# EAGLE design NIRGM V8 (EAGLE 8.5.1)

## Sheet 1 of 7: Voltage Regulator
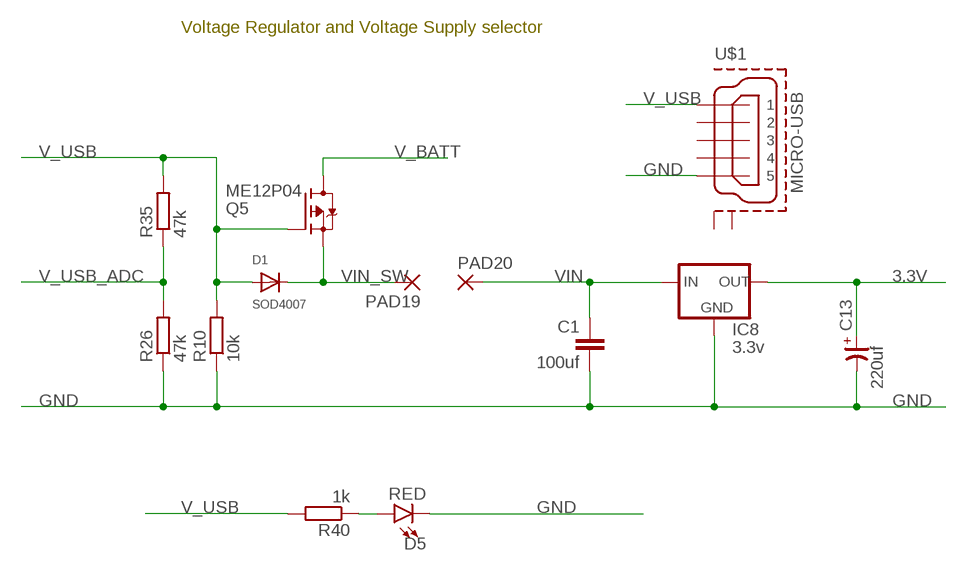
[diagram p0: schematic, sheet 1]

### Parts
C1  100uf  C-EUC1206K  [C1206K]
C13  220uf  CP-7343  [7343/T]
D1  SOD4007  DIODE_SOD-123FL  [SOD-123FL]
D5  RED  LED-GREEN1206  [LED-1206]
IC8  3.3v  LM1117TO252  [TO252]
PAD19  SMD2  [SMD1,27-2,54]
PAD20  SMD2  [SMD1,27-2,54]
Q5  ME12P04  FDD4141TO252  [TO252]
R10  10k  R-EU_R1206  [R1206]
R26  47k  R-EU_R1206  [R1206]
R35  47k  R-EU_R1206  [R1206]
R40  1k  R-EU_R1206  [R1206]
U$1  MICRO-USB  MICRO-USB-RECEPTACLE47589-0001  [47589-0001]

### Nets
3.3V: C13.+ IC8.3(OUT) ; also sheet 3,4,5,6,7
GND: C1.2 C13.- D5.C IC8.1(GND) R10.1 R26.1 U$1.5 ; also sheet 2,3,4,5,6,7
N$1: D5.A R40.1
V_BATT: Q5.3(D) ; also sheet 2,6
V_USB: D1.A Q5.1(G) R10.2 R35.2 R40.2 U$1.1 ; also sheet 2,6
V_USB_ADC: R26.2 R35.1 ; also sheet 4
VIN: C1.1 IC8.2(IN) PAD20.1(P)
VIN_SW: D1.C PAD19.1(P) Q5.2(S)
Unconnected: U$1.2 U$1.3 U$1.4 U$1.P$1(GND1) U$1.P$2(GND2)

### Notes on the sheet
- Voltage Regulator and Voltage Supply selector

## Sheet 2 of 7: Lithium-Polymer Battery Charger (1-cell)
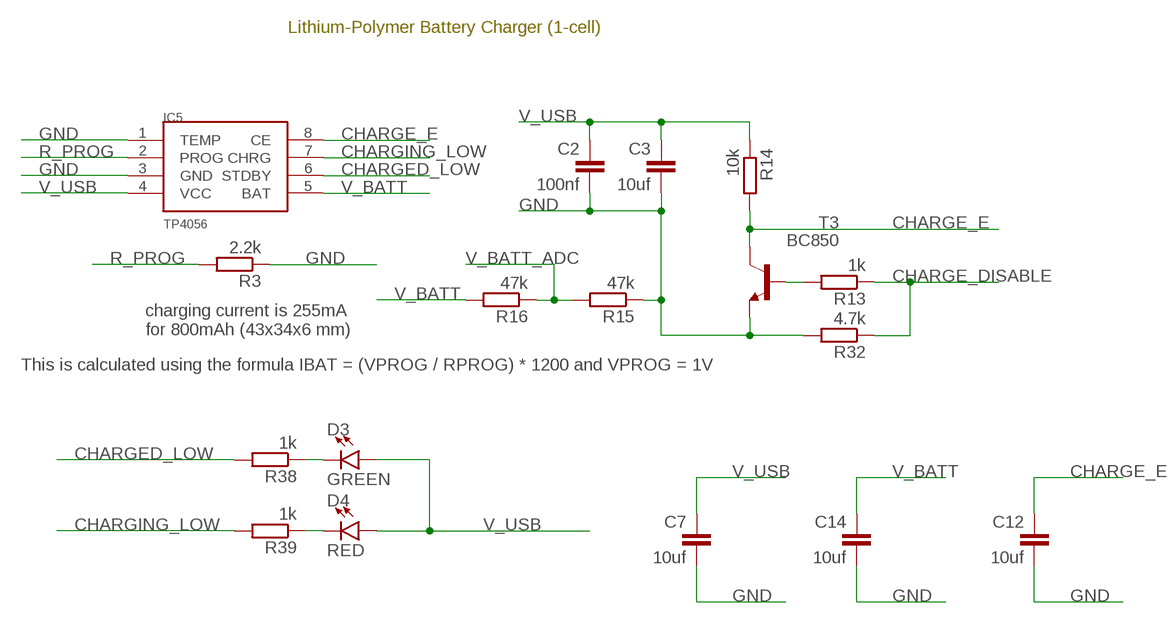
[diagram p1: schematic, sheet 2]

### Parts
C2  100nf  C-EUC1206K  [C1206K]
C3  10uf  C-EUC1206K  [C1206K]
C7  10uf  C-EUC1206K  [C1206K]
C12  10uf  C-EUC1206K  [C1206K]
C14  10uf  C-EUC1206K  [C1206K]
D3  GREEN  LED-GREEN1206  [LED-1206]
D4  RED  LED-GREEN1206  [LED-1206]
IC5  TP4056  [SOP-8]
R3  2.2k  R-EU_R1206  [R1206]
R13  1k  R-EU_R1206  [R1206]
R14  10k  R-EU_R1206  [R1206]
R15  47k  R-EU_R1206  [R1206]
R16  47k  R-EU_R1206  [R1206]
R32  4.7k  R-EU_R1206  [R1206]
R38  1k  R-EU_R1206  [R1206]
R39  1k  R-EU_R1206  [R1206]
T3  BC850  [SOT23]

### Nets
CHARGE_DISABLE: R13.1 R32.1 ; also sheet 4
CHARGE_E: C12.1 IC5.8(CE) R14.2 T3.3(C)
CHARGED_LOW: IC5.6(STDBY) R38.2 ; also sheet 4
CHARGING_LOW: IC5.7(CHRG) R39.2 ; also sheet 4
GND: C2.2 C3.2 C7.2 C12.2 C14.2 IC5.1(TEMP) IC5.3(GND) R3.1 R15.1 R32.2 T3.2(E) ; also sheet 1,3,4,5,6,7
N$2: D4.C R39.1
N$4: D3.C R38.1
N$13: R13.2 T3.1(B)
R_PROG: IC5.2(PROG) R3.2
V_BATT: C14.1 IC5.5(BAT) R16.2 ; also sheet 1,6
V_BATT_ADC: R15.2 R16.1 ; also sheet 4
V_USB: C2.1 C3.1 C7.1 D3.A D4.A IC5.4(VCC) R14.1 ; also sheet 1,6

### Notes on the sheet
- Lithium-Polymer Battery Charger (1-cell)
- charging current is 255mA
  for 800mAh (43x34x6 mm)
- This is calculated using the formula IBAT = (VPROG / RPROG) * 1200 and VPROG = 1V

## Sheet 3 of 7: LED Driver
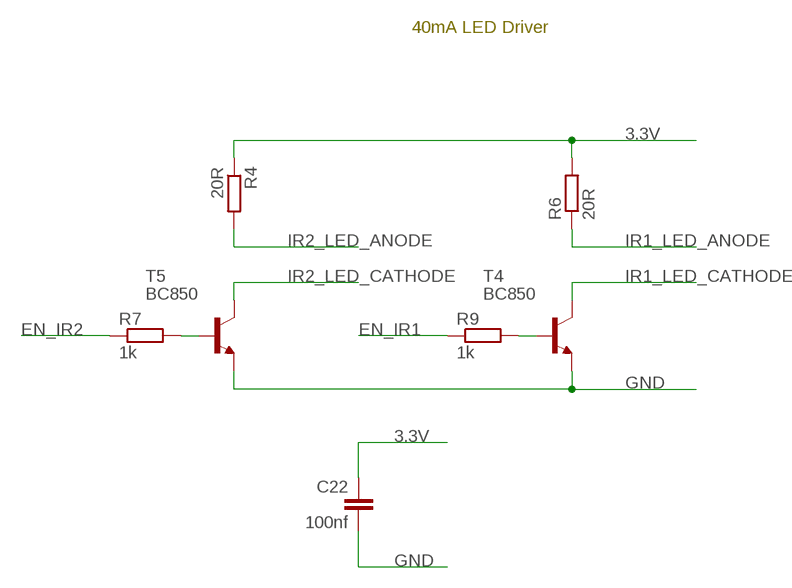
[diagram p2: schematic, sheet 3]

### Parts
C22  100nf  C-EUC1206K  [C1206K]
R4  20R  R-EU_R1206  [R1206]
R6  20R  R-EU_R1206  [R1206]
R7  1k  R-EU_R1206  [R1206]
R9  1k  R-EU_R1206  [R1206]
T4  BC850  [SOT23]
T5  BC850  [SOT23]

### Nets
3.3V: C22.1 R4.1 R6.2 ; also sheet 1,4,5,6,7
EN_IR1: R9.1 ; also sheet 4
EN_IR2: R7.1 ; also sheet 4
GND: C22.2 T4.2(E) T5.2(E) ; also sheet 1,2,4,5,6,7
IR1_LED_ANODE: R6.1 ; also sheet 6
IR1_LED_CATHODE: T4.3(C) ; also sheet 6
IR2_LED_ANODE: R4.2 ; also sheet 5
IR2_LED_CATHODE: T5.3(C) ; also sheet 5
N$3: R7.2 T5.1(B)
N$8: R9.2 T4.1(B)

### Notes on the sheet
- 40mA LED Driver

## Sheet 4 of 7: ESP32
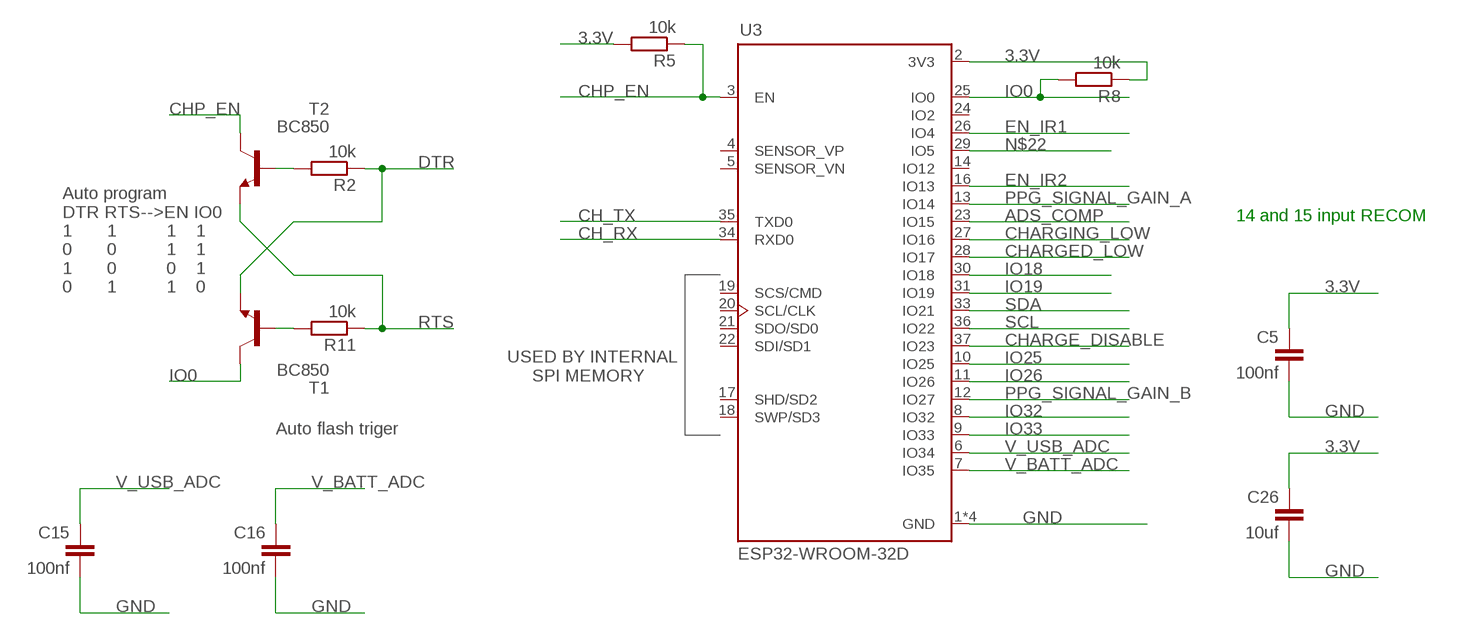
[diagram p3: schematic, sheet 4]

### Parts
C5  100nf  C-EUC1206K  [C1206K]
C15  100nf  C-EUC1206K  [C1206K]
C16  100nf  C-EUC1206K  [C1206K]
C26  10uf  C-EUC1206K  [C1206K]
R2  10k  R-EU_R1206  [R1206]
R5  10k  R-EU_R1206  [R1206]
R8  10k  R-EU_R1206  [R1206]
R11  10k  R-EU_R1206  [R1206]
T1  BC850  [SOT23]
T2  BC850  [SOT23]
U3  ESP32-WROOM-32D  [MODULE_ESP32-WROOM-32D]

### Nets
3.3V: C5.1 C26.1 R5.2 R8.1 U3.2(3V3) ; also sheet 1,3,5,6,7
ADS_COMP: U3.23(IO15) ; also sheet 7
CH_RX: U3.34(RXD0) ; also sheet 6
CH_TX: U3.35(TXD0) ; also sheet 6
CHARGE_DISABLE: U3.37(IO23) ; also sheet 2
CHARGED_LOW: U3.28(IO17) ; also sheet 2
CHARGING_LOW: U3.27(IO16) ; also sheet 2
CHP_EN: R5.1 T2.3(C) U3.3(EN) ; also sheet 6
DTR: R2.1 T1.2(E) ; also sheet 6
EN_IR1: U3.26(IO4) ; also sheet 3
EN_IR2: U3.16(IO13) ; also sheet 3
GND: C5.2 C15.2 C16.2 C26.2 U3.1(GND) U3.15(GND) U3.38(GND) U3.39(GND) ; also sheet 1,2,3,5,6,7
IO0: R8.2 T1.3(C) U3.25(IO0) ; also sheet 6
IO18: U3.30(IO18) ; also sheet 6
IO19: U3.31(IO19) ; also sheet 6
IO25: U3.10(IO25) ; also sheet 6
IO26: U3.11(IO26) ; also sheet 6
IO32: U3.8(IO32) ; also sheet 6
IO33: U3.9(IO33) ; also sheet 6
N$5: R11.2 T1.1(B)
N$18: R2.2 T2.1(B)
N$22: U3.29(IO5)
PPG_SIGNAL_GAIN_A: U3.13(IO14) ; also sheet 5
PPG_SIGNAL_GAIN_B: U3.12(IO27) ; also sheet 5
RTS: R11.1 T2.2(E) ; also sheet 6
SCL: U3.36(IO22) ; also sheet 6,7
SDA: U3.33(IO21) ; also sheet 6,7
V_BATT_ADC: C16.1 U3.7(IO35) ; also sheet 2
V_USB_ADC: C15.1 U3.6(IO34) ; also sheet 1
Unconnected: U3.4(SENSOR_VP) U3.5(SENSOR_VN) U3.14(IO12) U3.17(SHD/SD2) U3.18(SWP/SD3) U3.19(SCS/CMD) U3.20(SCL/CLK) U3.21(SDO/SD0) U3.22(SDI/SD1) U3.24(IO2)

### Notes on the sheet
- 14 and 15 input RECOM
- Auto program
  DTR RTS-->EN IO0 
  1       1          1    1
  0       0          1    1
  1       0          0    1
  0       1          1    0
- USED BY INTERNAL
       SPI MEMORY
- Auto flash triger

## Sheet 5 of 7: Programable gain amplifier
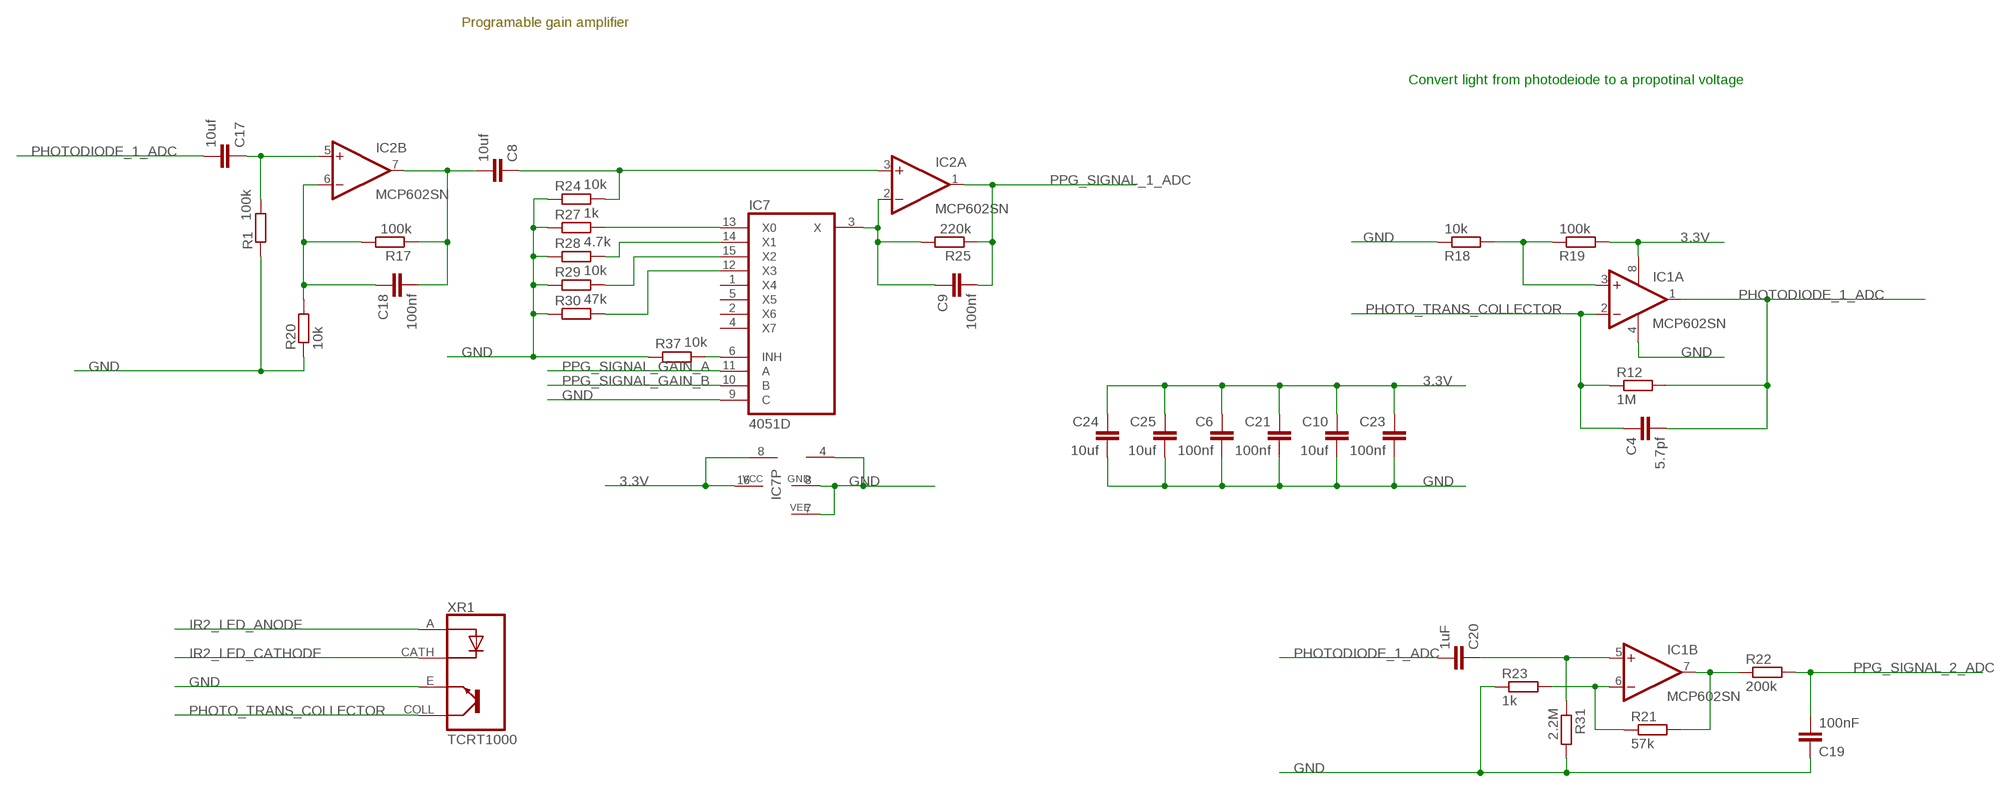
[diagram p4: schematic, sheet 5]

### Parts
C4  5.7pf  C-EUC1206K  [C1206K]
C6  100nf  C-EUC1206K  [C1206K]
C8  10uf  C-EUC1206K  [C1206K]
C9  100nf  C-EUC1206K  [C1206K]
C10  10uf  C-EUC1206K  [C1206K]
C17  10uf  C-EUC1206K  [C1206K]
C18  100nf  C-EUC1206K  [C1206K]
C19  100nF  C-EUC1206K  [C1206K]
C20  1uF  C-EUC1206K  [C1206K]
C21  100nf  C-EUC1206K  [C1206K]
C23  100nf  C-EUC1206K  [C1206K]
C24  10uf  C-EUC1206K  [C1206K]
C25  10uf  C-EUC1206K  [C1206K]
IC1  MCP602SN  [SO08]
IC2  MCP602SN  [SO08]
IC7  4051D  [SO16]
R1  100k  R-EU_R1206  [R1206]
R12  1M  R-EU_R1206  [R1206]
R17  100k  R-EU_R1206  [R1206]
R18  10k  R-EU_R1206  [R1206]
R19  100k  R-EU_R1206  [R1206]
R20  10k  R-EU_R1206  [R1206]
R21  57k  R-EU_R1206  [R1206]
R22  200k  R-EU_R1206  [R1206]
R23  1k  R-EU_R1206  [R1206]
R24  10k  R-EU_R1206  [R1206]
R25  220k  R-EU_R1206  [R1206]
R27  1k  R-EU_R1206  [R1206]
R28  4.7k  R-EU_R1206  [R1206]
R29  10k  R-EU_R1206  [R1206]
R30  47k  R-EU_R1206  [R1206]
R31  2.2M  R-EU_R1206  [R1206]
R37  10k  R-EU_R1206  [R1206]
XR1  TCRT1000  [XDCR_TCRT1000]

### Nets
3.3V: C6.1 C10.1 C21.1 C23.1 C24.1 C25.1 IC1.8(P:V+) IC2.8(P:V+) IC7.16(VCC) R19.2 ; also sheet 1,3,4,6,7
GND: C6.2 C10.2 C19.1 C21.2 C23.2 C24.2 C25.2 IC1.4(P:V-) IC2.4(P:V-) IC7.7(VEE) IC7.8(GND) IC7.9(C) R1.1 R18.1 R20.1 R23.1 R24.1 R27.1 R28.1 R29.1 R30.1 R31.2 R37.1 XR1.E ; also sheet 1,2,3,4,6,7
IR2_LED_ANODE: XR1.A ; also sheet 3
IR2_LED_CATHODE: XR1.CATH(C) ; also sheet 3
N$6: C17.1 IC2.5(B:+IN) R1.2
N$10: IC1.3(A:+IN) R18.2 R19.1
N$11: IC7.6(INH) R37.2
N$12: C8.2 C18.2 IC2.7(B:OUT) R17.1
N$14: C18.1 IC2.6(B:-IN) R17.2 R20.2
N$15: IC1.6(B:-IN) R21.1 R23.2
N$16: C20.1 IC1.5(B:+IN) R31.1
N$17: IC1.7(B:OUT) R21.2 R22.1
N$29: C8.1 IC2.3(A:+IN) R24.2
N$39: C9.1 IC2.2(A:-IN) IC7.3(X) R25.2
N$40: IC7.13(X0) R27.2
N$41: IC7.14(X1) R28.2
N$42: IC7.15(X2) R29.2
N$43: IC7.12(X3) R30.2
PHOTO_TRANS_COLLECTOR: C4.1 IC1.2(A:-IN) R12.1 XR1.COLL(CO)
PHOTODIODE_1_ADC: C4.2 C17.2 C20.2 IC1.1(A:OUT) R12.2 ; also sheet 7
PPG_SIGNAL_1_ADC: C9.2 IC2.1(A:OUT) R25.1 ; also sheet 7
PPG_SIGNAL_2_ADC: C19.2 R22.2 ; also sheet 7
PPG_SIGNAL_GAIN_A: IC7.11(A) ; also sheet 4
PPG_SIGNAL_GAIN_B: IC7.10(B) ; also sheet 4
Unconnected: IC7.1(X4) IC7.2(X6) IC7.4(X7) IC7.5(X5)

### Notes on the sheet
- Programable gain amplifier
- Convert light from photodeiode to a propotinal voltage

## Sheet 6 of 7: OLED LCD and Connectors
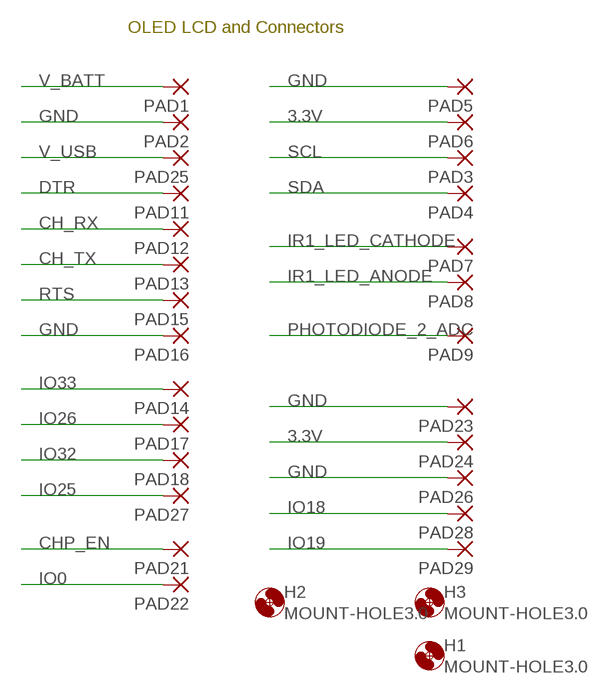
[diagram p5: schematic, sheet 6]

### Parts
H1  MOUNT-HOLE3.0  [3,0]
H2  MOUNT-HOLE3.0  [3,0]
H3  MOUNT-HOLE3.0  [3,0]
PAD1  WIREPADSMD5-2,5  [5-2,5]
PAD2  WIREPADSMD5-2,5  [5-2,5]
PAD3  SMD2  [SMD1,27-2,54]
PAD4  SMD2  [SMD1,27-2,54]
PAD5  SMD2  [SMD1,27-2,54]
PAD6  SMD2  [SMD1,27-2,54]
PAD7  SMD2  [SMD1,27-2,54]
PAD8  SMD2  [SMD1,27-2,54]
PAD9  SMD2  [SMD1,27-2,54]
PAD11  SMD2  [SMD1,27-2,54]
PAD12  SMD2  [SMD1,27-2,54]
PAD13  SMD2  [SMD1,27-2,54]
PAD14  SMD2  [SMD1,27-2,54]
PAD15  SMD2  [SMD1,27-2,54]
PAD16  SMD2  [SMD1,27-2,54]
PAD17  SMD2  [SMD1,27-2,54]
PAD18  SMD2  [SMD1,27-2,54]
PAD21  SMD2  [SMD1,27-2,54]
PAD22  SMD2  [SMD1,27-2,54]
PAD23  SMD2  [SMD1,27-2,54]
PAD24  SMD2  [SMD1,27-2,54]
PAD25  SMD2  [SMD1,27-2,54]
PAD26  SMD2  [SMD1,27-2,54]
PAD27  SMD2  [SMD1,27-2,54]
PAD28  SMD2  [SMD1,27-2,54]
PAD29  SMD2  [SMD1,27-2,54]

### Nets
3.3V: PAD6.1(P) PAD24.1(P) ; also sheet 1,3,4,5,7
CH_RX: PAD12.1(P) ; also sheet 4
CH_TX: PAD13.1(P) ; also sheet 4
CHP_EN: PAD21.1(P) ; also sheet 4
DTR: PAD11.1(P) ; also sheet 4
GND: PAD2.1(P) PAD5.1(P) PAD16.1(P) PAD23.1(P) PAD26.1(P) ; also sheet 1,2,3,4,5,7
IO0: PAD22.1(P) ; also sheet 4
IO18: PAD28.1(P) ; also sheet 4
IO19: PAD29.1(P) ; also sheet 4
IO25: PAD27.1(P) ; also sheet 4
IO26: PAD17.1(P) ; also sheet 4
IO32: PAD18.1(P) ; also sheet 4
IO33: PAD14.1(P) ; also sheet 4
IR1_LED_ANODE: PAD8.1(P) ; also sheet 3
IR1_LED_CATHODE: PAD7.1(P) ; also sheet 3
PHOTODIODE_2_ADC: PAD9.1(P) ; also sheet 7
RTS: PAD15.1(P) ; also sheet 4
SCL: PAD3.1(P) ; also sheet 4,7
SDA: PAD4.1(P) ; also sheet 4,7
V_BATT: PAD1.1(P) ; also sheet 1,2
V_USB: PAD25.1(P) ; also sheet 1,2

### Notes on the sheet
- OLED LCD and Connectors

## Sheet 7 of 7: ADS1115
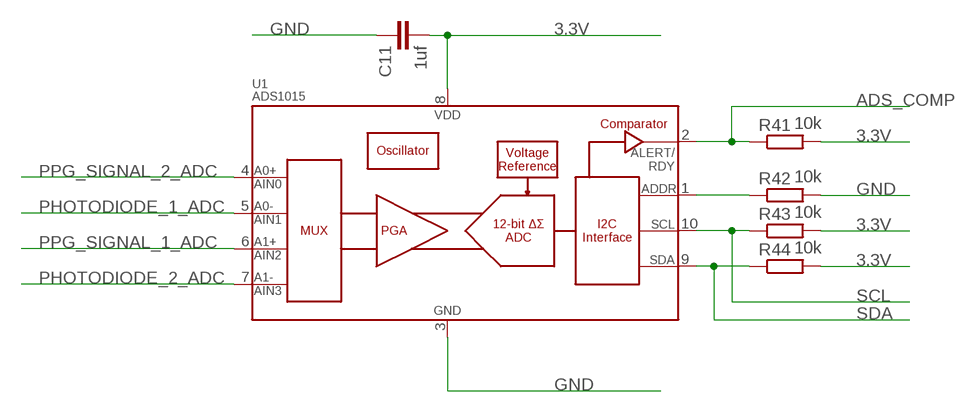
[diagram p6: schematic, sheet 7]

### Parts
C11  1uf  C-EUC1206K  [C1206K]
R41  10k  R-EU_R1206  [R1206]
R42  10k  R-EU_R1206  [R1206]
R43  10k  R-EU_R1206  [R1206]
R44  10k  R-EU_R1206  [R1206]
U1  ADS1015  [MSOP10]

### Nets
3.3V: C11.2 R41.2 R43.2 R44.2 U1.8(VDD) ; also sheet 1,3,4,5,6
ADS_COMP: R41.1 U1.2(ALERT/RDY) ; also sheet 4
GND: C11.1 R42.2 U1.3(VSS) ; also sheet 1,2,3,4,5,6
N$9: R42.1 U1.1(ADDR)
PHOTODIODE_1_ADC: U1.5(AIN1) ; also sheet 5
PHOTODIODE_2_ADC: U1.7(AIN3) ; also sheet 6
PPG_SIGNAL_1_ADC: U1.6(AIN2) ; also sheet 5
PPG_SIGNAL_2_ADC: U1.4(AIN0) ; also sheet 5
SCL: R43.1 U1.10(SCL) ; also sheet 4,6
SDA: R44.1 U1.9(SDA) ; also sheet 4,6

## Library data of the parts
C1-C12 C14-C26 = rcl:C-EU: CAPACITOR, European symbol; SPICEPREFIX: C
C13 = cap-master:CP-: POLARIZED CAP
D1 = adafruit:DIODE: Diode SMADIODE - SMA Surface Mount Package 20V 1A Schottky Diode Digikey: 641-1014-6-ND DO-1N4148 - Through Hole Small Current Diode SOD-123 20V 1 A (.5mV Vf) Schottky Diode - Digikey: MBRX120TPMSCT-ND SOD-323 10V 570mA (.38mV Vf, 3ns) Schottky Diode - Digikey: ZLLS410CT-ND SOD-523 30V 30mA Schottky Diode (RB751S-40TE61) - Digikey: RB751S-40TE61CT-ND SOT23-R/W - SOT23 Package (R = Solder Paste/Reflow Ovens, W = Hand-Soldering) BAT54Film 40V 300mA - Digikey: 497-7162-1-ND
D3 = SparkFun-LED:LED-GREEN: Green SMD LED Used in manufacturing of various products at SparkFun Packages: 0603 - SMD 0603 package [Product Link] <http://www.futureelectronics.com/en/technologies/semiconductors/optoelectronics/leds/Pages/9894312-LTST-C190GKT.aspx?CrossPart=HSMG-C190&IM=0> LilyPad 1206 - SMD1206 LilyPad package [Product Link] <http://www.futureelectronics.com/en/Technologies/Product.aspx?ProductID=IN150NGHARVATEKCORPORATION2049943&IM=0> 1206 - SMD1206 package [Product Link] <http://www.futureelectronics.com/en/technologies/semiconductors/optoelectronics/leds/Pages/8315665-LTST-C150KGKT.aspx?IM=0> 1206 Bottom Mount -SMD 1206 Bottom Mount [Product Link] <http://www.digikey.com/product-detail/en/lite-on-inc/LTST-C230KGKT/160-1456-1-ND/386854> SparkFun Products: Pro Mini 328 -5V <https://www.sparkfun.com/products/821> RedBoard <https://www.sparkfun.com/products/12757> MP3 Trigger <https://www.sparkfun.com/products/13720> Makey Makey <https://www.sparkfun.com/products/11076>; PROD_ID: DIO-00862
D4 D5 = SparkFun-LED:LED-GREEN: Green SMD LED Used in manufacturing of various products at SparkFun Packages: 0603 - SMD 0603 package [Product Link] <http://www.futureelectronics.com/en/technologies/semiconductors/optoelectronics/leds/Pages/9894312-LTST-C190GKT.aspx?CrossPart=HSMG-C190&IM=0> LilyPad 1206 - SMD1206 LilyPad package [Product Link] <http://www.futureelectronics.com/en/Technologies/Product.aspx?ProductID=IN150NGHARVATEKCORPORATION2049943&IM=0> 1206 - SMD1206 package [Product Link] <http://www.futureelectronics.com/en/technologies/semiconductors/optoelectronics/leds/Pages/8315665-LTST-C150KGKT.aspx?IM=0> 1206 Bottom Mount -SMD 1206 Bottom Mount [Product Link] <http://www.digikey.com/product-detail/en/lite-on-inc/LTST-C230KGKT/160-1456-1-ND/386854> SparkFun Products: Pro Mini 328 -5V <https://www.sparkfun.com/products/821> RedBoard <https://www.sparkfun.com/products/12757> MP3 Trigger <https://www.sparkfun.com/products/13720> Makey Makey <https://www.sparkfun.com/products/11076>; PROD_ID: DIO-00862; VALUE: GREEN
H1-H3 = holes:MOUNT-HOLE: MOUNTING HOLE with drill center marker
IC1 IC2 = linear:MCP602: Single Op Amp 2.7V to 6.0V Single Supply CMOS Source: http://ww1.microchip.com/downloads/en/DeviceDoc/21314g.pdf
IC5 = TP4056:TP4056
IC7 = 40xx:4051: 8-channel ANALOG MULTIPLEXER
IC8 = v-reg-2:LM1117
PAD1 PAD2 = wirepad:WIREPAD: Wire PAD connect wire on PCB
PAD3-PAD9 PAD11-PAD29 = wirepad:SMD2: SMD PAD
Q5 = transistor-fet:FDD4141: P-Channel PowerTrench® MOSFET Source: FDD4141.pdf
R1-R32 R35 R37-R44 = rcl:R-EU_: RESISTOR, European symbol; SPICEPREFIX: R
T1-T5 = transistor:BC850: NPN TRANSISTOR
U1 = SparkFun-IC-Conversion:ADS1015: ADS1015 12-BIT ADC 12-Bit Del-Sig ADC Four single-ended inputs or two differential inputs Internal PGA I2C interface 2.0-5.5V SparkFun Products SparkFun Block for Intel Edison - ADC <https://www.sparkfun.com/products/13770> (DEV-13770); PROD_ID: IC-12270
U3 = ESP32-WROOM-32DMODED:ESP32-WROOM-32D: IC: SoC; GPIO, I2C, I2S, IR, SD, SDIO, SPI, UART; 2.7÷3.6VDC; 20dBm; AVAILABILITY: Unavailable; DESCRIPTION: IC: SoC; GPIO, I2C, I2S, IR, SD, SDIO, SPI, UART; 2.7÷3.6VDC; 20dBm; MF: Espressif Systems; MP: ESP32-WROOM-32D; PACKAGE: Module Espressif Systems; PRICE: None
U$1 = con-molex-usb:MICRO-USB-RECEPTACLE: MICRO USB RECEPTACLES Micro-USB Receptacles, SMT, Lead-Free from MOLEX <http://www.molex.com/>. (C) 2014 Tomasz Boleslaw CEDRO, cederom@tlen.pl, http://www.tomek.cedro.info. Version 0.1 (2014-01-17): Initial release. Version 0.2 (2014-02-06): Updated 47589-0001 footprint pins/pads/milling. Following devices are included: 1. 47589-0001 Micro-USB AB Receptacle, Bottom Mount, SMT, Lead-Free <http://www.molex.com/molex/products/datasheet.jsp?part=active/0475890001_IO_CONNECTORS.xml> (Technical Drawing <http://www.molex.com/pdm_docs/sd/475890001_sd.pdf>).
XR1 = TCRT1000:TCRT1000: Optical Sensor The TCRT1000 and TCRT1010 are reflective sensors which include an infrared emitter and phototransistor in a leaded package which blocks visible light; AVAILABILITY: Unavailable; DESCRIPTION: 950 nm 50 mA Through Hole Reflective Optical Sensor with Transistor Output; MF: Vishay; MP: TCRT1000; PACKAGE: PCB Mount Vishay; PRICE: None

## Board
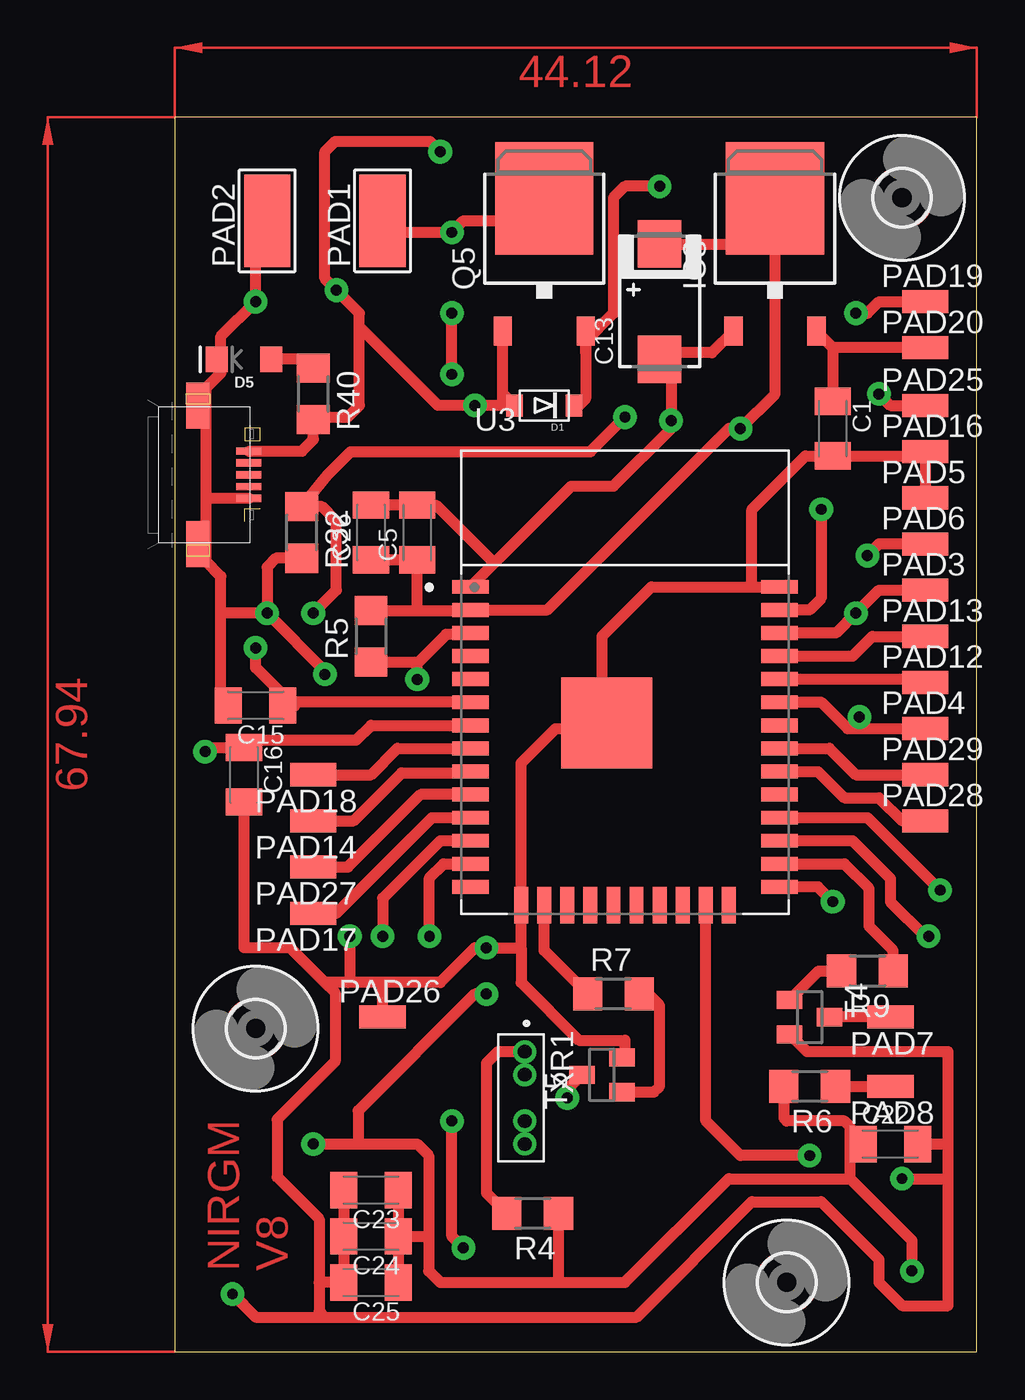
[diagram p7: board, top side]
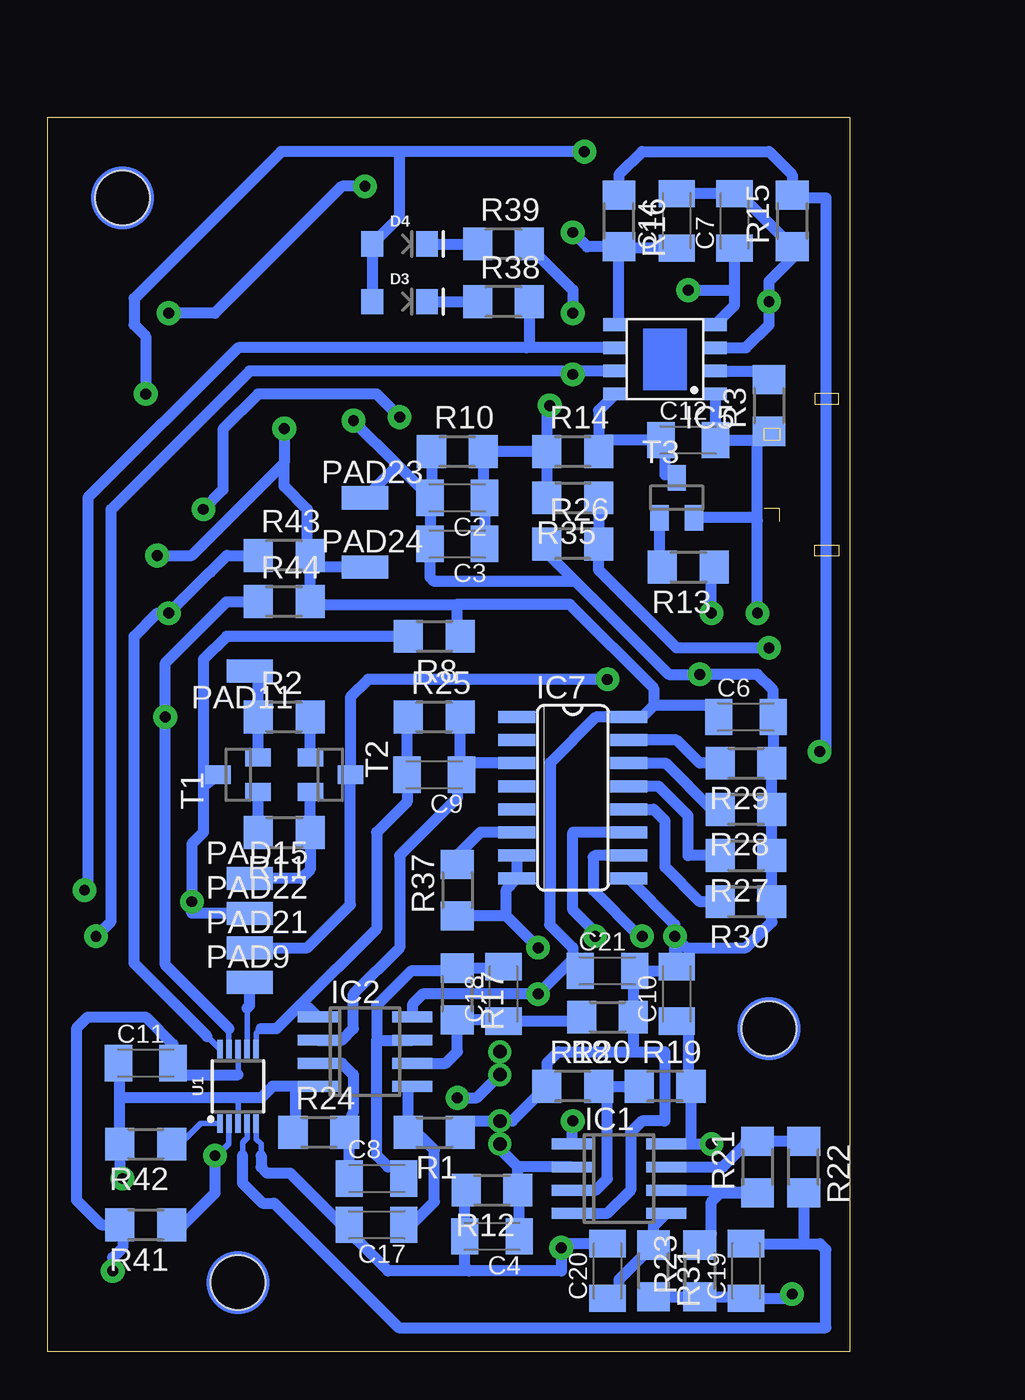
[diagram p8: board, bottom side, seen from below]

Size 44.12 x 67.94 mm. Coordinates in mm from the lower left corner, seen from the top.
Outline: 0,0 44.12,0 44.12,67.94 0,67.94 0,0
Copper layers (1*16): Top 0.035mm / dielectric 1.5mm / Bottom 0.035mm
Design rules "default *": minimum track width 6mil, minimum drill 0.35mm, track to track 12mil, track to pad 12mil, pad to pad 6mil, via to via 6mil, smd to smd 6mil, copper to edge 40mil, drill to drill 6mil, minimum pad ring 10mil, minimum via ring 8mil, stop-mask expansion 4mil, vias tented up to drill 0mil, thermal gap 10mil

### Footprints (pad centres in the part's own frame; a part is rotated, then mirrored left to right if it is on the bottom)
C1206K = smd 1.5 x 2: 1 -1.5,0; 2 1.5,0
7343/T = smd 2.6 x 2.4: + 3.175,0; - -3.175,0
SOD-123FL = smd 0.91 x 1.22: A 1.637,0; C -1.637,0
LED-1206 = smd 1.2 x 1.4: A -1.5,0; C 1.5,0
3,0 = hole 3: 0,0
SO08 = smd 0.6 x 2.2: 1 -1.905,-2.6; 2 -0.635,-2.6; 3 0.635,-2.6; 4 1.905,-2.6; 5 1.905,2.6; 6 0.635,2.6; 7 -0.635,2.6; 8 -1.905,2.6
SOP-8 = smd 1.3 x 0.7: 1 -2.75,1.905; 2 -2.75,0.635; 3 -2.75,-0.635; 4 -2.75,-1.905; 5 2.75,-1.905; 6 2.75,-0.635; 7 2.75,0.635; 8 2.75,1.905
SO16 = smd 0.66 x 2.032: 1 -4.445,-3.073; 2 -3.175,-3.073; 3 -1.905,-3.073; 4 -0.635,-3.073; 5 0.635,-3.073; 6 1.905,-3.073; 7 3.175,-3.073; 8 4.445,-3.073; 9 4.445,3.073; 10 3.175,3.073; 11 1.905,3.073; 12 0.635,3.073; 13 -0.635,3.073; 14 -1.905,3.073; 15 -3.175,3.073; 16 -4.445,3.073
TO252 = smd 1 x 1.6: 1 -2.28,-6.07; 2 2.28,-6.07 | smd 5.4 x 6.2: 3 0,1.23
5-2,5 = smd 2.54 x 5.08: 1 0,0
SMD1,27-2,54 = smd 1.27 x 2.54: 1 0,0
TO252' = smd 1 x 1.6: 1 -2.28,-4.8; 2 2.28,-4.8 | smd 5.4 x 6.2: 3 0,2.5
R1206 = smd 1.6 x 1.803: 1 -1.422,0; 2 1.422,0
SOT23 = smd 1 x 1.4: 1 -0.95,-1.1; 2 0.95,-1.1; 3 0,1.1
MSOP10 = smd 0.3 x 1: 1 -1,-2.05; 2 -0.5,-2.05; 3 0,-2.05; 4 0.5,-2.05; 5 1,-2.05; 6 1,2.05; 7 0.5,2.05; 8 0,2.05; 9 -0.5,2.05; 10 -1,2.05
MODULE_ESP32-WROOM-32D = smd 2 x 0.762: 1 -8.5,5.26; 2 -8.5,3.99; 3 -8.5,2.72; 4 -8.5,1.45; 5 -8.5,0.18; 6 -8.5,-1.09; 7 -8.5,-2.36; 8 -8.5,-3.63; 9 -8.5,-4.9; 10 -8.5,-6.17; 11 -8.5,-7.44; 12 -8.5,-8.71; 13 -8.5,-9.98; 14 -8.5,-11.25; 25 8.5,-11.25; 26 8.5,-9.98; 27 8.5,-8.71; 28 8.5,-7.44; 29 8.5,-6.17; 30 8.5,-4.9; 31 8.5,-3.63; 32 8.5,-2.36; 33 8.5,-1.09; 34 8.5,0.18; 35 8.5,1.45; 36 8.5,2.72; 37 8.5,3.99; 38 8.5,5.26 | smd 0.762 x 2: 15 -5.715,-12.25; 16 -4.445,-12.25; 17 -3.175,-12.25; 18 -1.905,-12.25; 19 -0.635,-12.25; 20 0.635,-12.25; 21 1.905,-12.25; 22 3.175,-12.25; 23 4.445,-12.25; 24 5.715,-12.25 | smd 5 x 5: 39 -1,-2.24
47589-0001 = smd 1.35 x 0.4: 1 2.8,1.3; 2 2.8,0.65; 3 2.8,0; 4 2.8,-0.65; 5 2.8,-1.3 | smd 1.27 x 2.54: P$1 0,3.81; P$2 0,-3.81
XDCR_TCRT1000 = drill 0.75 pad 1.1: A -2.54,0.2; CATH -1.27,0.2; COLL 2.54,0.2; E 1.27,0.2

### Placement (x,y rotation side)
C1  36.2,50.8 270 top
C2  21.59,46.99 180 bottom
C3  21.59,44.45 180 bottom
C4  19.68,6.35 180 bottom
C5  13.34,45.09 90 top
C6  5.71,34.92 0 bottom
C7  6.35,62.23 90 bottom
C8  26.04,9.53 0 bottom
C9  22.86,31.75 180 bottom
C10  9.53,19.68 90 bottom
C11  38.73,15.88 0 bottom
C12  8.89,50.16 0 bottom
C13  26.67,57.78 90 top
C14  9.53,62.23 90 bottom
C15  4.45,35.56 180 top
C16  3.81,31.75 270 top
C17  26.04,6.99 180 bottom
C18  19.05,19.68 90 bottom
C19  5.71,4.45 90 bottom
C20  13.34,4.45 90 bottom
C21  13.34,20.95 0 bottom
C22  39.37,11.43 0 top
C23  10.79,8.89 180 top
C24  10.79,6.35 180 top
C25  10.79,3.81 180 top
C26  10.79,45.09 90 top
D1  20.32,52.07 180 top
D3  24.77,57.78 0 bottom
D4  24.77,60.96 0 bottom
D5  3.81,54.61 180 top
H1  40.01,63.5 0 top
H2  4.45,17.78 0 top
H3  33.66,3.81 0 top
IC1  12.7,9.53 270 bottom
IC2  26.67,16.51 270 bottom
IC5  10.16,54.61 180 bottom
IC7  15.24,30.48 270 bottom
IC8  33.02,62.23 0 top
PAD1  11.43,62.23 0 top
PAD2  5.08,62.23 0 top
PAD3  41.27,41.91 270 top
PAD4  41.27,34.29 270 top
PAD5  41.27,46.99 270 top
PAD6  41.27,44.45 270 top
PAD7  39.37,18.41 90 top
PAD8  39.37,14.61 90 top
PAD9  33.02,20.32 270 bottom
PAD11  33.02,37.47 90 bottom
PAD12  41.27,36.83 270 top
PAD13  41.27,39.37 270 top
PAD14  7.62,29.21 90 top
PAD15  33.02,26.04 270 bottom
PAD16  41.27,49.53 270 top
PAD17  7.62,24.13 90 top
PAD18  7.62,31.75 90 top
PAD19  41.27,57.78 270 top
PAD20  41.27,55.24 270 top
PAD21  33.02,22.23 270 bottom
PAD22  33.02,24.13 270 bottom
PAD23  26.67,46.99 270 bottom
PAD24  26.67,43.18 270 bottom
PAD25  41.27,52.07 270 top
PAD26  11.43,18.41 270 top
PAD27  7.62,26.67 90 top
PAD28  41.27,29.21 270 top
PAD29  41.27,31.75 270 top
Q5  ME12P04  [TO252']  20.32,60.96 0 top
R1  22.86,12.06 180 bottom
R2  31.11,34.92 0 bottom
R3  4.45,52.07 90 bottom
R4  19.68,7.62 180 top
R5  10.79,39.37 90 top
R6  34.92,14.61 180 top
R7  24.13,19.68 0 top
R8  22.86,39.37 180 bottom
R9  38.1,20.95 180 top
R10  21.59,49.53 0 bottom
R11  31.11,28.57 180 bottom
R12  19.68,8.89 180 bottom
R13  8.89,43.18 180 bottom
R14  15.24,49.53 0 bottom
R15  3.17,62.23 90 bottom
R16  12.7,62.23 270 bottom
R17  21.59,19.68 270 bottom
R18  15.24,14.61 0 bottom
R19  10.16,14.61 0 bottom
R20  13.34,18.41 180 bottom
R21  5.08,10.16 90 bottom
R22  2.54,10.16 270 bottom
R23  8.26,4.45 90 bottom
R24  29.21,12.06 0 bottom
R25  22.86,34.92 0 bottom
R26  15.24,44.45 0 bottom
R27  5.71,27.3 180 bottom
R28  5.71,29.84 180 bottom
R29  5.71,32.38 180 bottom
R30  5.71,24.77 180 bottom
R31  10.79,4.45 270 bottom
R32  6.99,45.09 270 top
R35  15.24,46.99 180 bottom
R37  21.59,25.4 90 bottom
R38  19.05,57.78 0 bottom
R39  19.05,60.96 0 bottom
R40  7.62,52.7 270 top
R41  38.73,6.99 180 bottom
R42  38.73,11.43 180 bottom
R43  31.11,43.81 0 bottom
R44  31.11,41.27 0 bottom
T1  33.66,31.75 90 bottom
T2  28.57,31.75 270 bottom
T3  9.53,46.99 0 bottom
T4  34.92,18.41 270 top
T5  23.5,15.24 90 top
U1  33.66,14.61 0 bottom
U3  24.77,36.83 0 top
U$1  1.27,48.26 0 top
XR1  19.05,13.97 270 top

### Tracks (layer width: path | path; a pad name or v marks a point on that pad's centre or on a via)
3.3V  (via drill 0.6 pad 1.3)
  Top 0.61: IC8.3 33.02,52.7 v31.11,50.8 30.48,50.8 20.5,40.82 U3.2 16.24,40.79 13.34,40.79 | IC8.3 32.12,63.09 | R5.2 13.34,40.79 | 13.34,40.79 C5.1 C26.1 | C13.+ 31.75,60.96 32.98,62.19 IC8.3 | 33.5,13.82 R6.2 33.5,12.85 33.66,12.7 36.83,12.7 37.15,12.38 37.15,11.43 | v17.14,19.68 16.51,19.68 10.09,13.27 IC1.8 | 20.95,3.81 14.61,3.81 13.97,4.45 13.97,6.35 | 20.95,3.81 24.77,3.81 30.48,9.53 37.15,9.53 | 37.15,9.53 37.15,11.43 | 37.15,9.53 40.55,6.12 v40.55,4.45 | C22.1 37.15,11.43 | v7.62,11.43 IC1.8 | IC1.8 13.34,11.43 13.97,10.79 13.97,6.35 | C23.1 C24.1 | C24.1 C25.1 | C24.1 13.97,6.35 | PAD6.1 38.73,44.45 v38.1,43.81 | R4.1 21.11,3.96 20.95,3.81
  Bottom 0.305: 33.66,15.24 U1.8
  Bottom 0.61: v31.11,50.8 31.11,48.9 | v38.1,43.81 36.2,43.81 31.11,48.9 | 29.69,43.18 R44.2 29.54,41.12 21.59,41.12 | 29.69,43.18 R43.2 29.84,43.97 29.84,46.35 31.11,47.62 31.11,48.9 | 33.66,15.24 36.6,15.24 C11.2 37.23,16.91 38.73,18.41 41.91,18.41 42.55,17.78 42.55,8.35 41.18,6.99 R41.2 40.01,6.83 40.01,5.71 40.55,5.17 v40.55,4.45 | 10.79,35.56 10.79,36.52 15.39,41.12 21.59,41.12 | C6.1 7.85,35.56 10.79,35.56 | R8.1 21.59,39.52 21.59,41.12 | PAD24.1 29.69,43.18 | 10.79,35.56 11.43,34.92 IC7.16 13.97,34.92 16.48,32.41 16.48,25.37 16.51,25.34 16.51,23.5 15.24,22.23 15.24,21.59 | IC2.8 24.07,19.11 23.5,19.68 v17.14,19.68 15.24,21.59 | IC1.8 8.89,11.43 | 8.89,11.43 v7.62,11.43 | C21.1 14.84,21.18 15.24,21.59 | C10.1 8.89,17.55 8.89,14.76 R19.2 8.74,11.58 8.89,11.43
ADS_COMP  (via drill 0.6 pad 1.3)
  Top 0.61: v34.92,10.79 31.11,10.79 29.21,12.7 U3.23
  Bottom 0.305: U1.2 34.16,11.43 34.79,10.79 v34.92,10.79
  Bottom 0.61: v34.92,10.79 34.92,8.72 36.66,6.99 R41.1
CH_RX
  Top 0.61: PAD12.1 41.09,37.01 U3.34
CH_TX
  Top 0.61: U3.35 37.28,38.28 38.38,39.37 PAD13.1
CHARGE_DISABLE  (via drill 0.6 pad 1.3)
  Top 0.61: v24.77,51.44 22.86,49.53 9.68,49.53 8.41,48.26 R32.1 8.1,46.51 8.89,45.72 8.89,41.91 v7.62,40.64 | U3.37 34.92,40.82 35.56,41.45 v35.56,46.35
  Bottom 0.61: v7.62,40.64 7.62,43.18 R13.1 | v35.56,46.35 34.48,47.43 34.48,50.77 32.55,52.7 26.04,52.7 v24.77,51.44
CHARGE_E
  Bottom 0.61: IC5.8 13.82,51.8 13.82,50.16 | 13.82,50.16 R14.2 | 13.82,50.16 C12.1 10.16,49.94 10.16,48.26 9.7,48.26 T3.3
CHARGED_LOW  (via drill 0.6 pad 1.3)
  Top 0.61: U3.28 38.1,29.39 v42.09,25.4 v42.1,25.4
  Bottom 0.61: IC5.6 17.78,55.24 | 17.78,55.24 33.66,55.24 41.91,46.99 41.91,25.59 v42.1,25.4 | R38.2 17.63,55.4 17.78,55.24
CHARGING_LOW  (via drill 0.6 pad 1.3)
  Top 0.61: v15.24,53.78 v15.24,57.15 | U3.27 37.28,28.12 39.37,26.04 39.37,24.77 41.27,22.86 v41.47,22.86
  Bottom 0.61: IC5.7 15.24,53.98 | 15.24,53.98 v15.24,53.78 | v15.24,57.15 15.24,58.42 17.63,60.81 R39.2 | 15.24,53.98 33.02,53.98 40.64,46.35 40.64,23.69 v41.47,22.86
CHP_EN  (via drill 0.6 pad 1.3)
  Top 0.61: U3.3 16.19,39.47 14.93,39.47 13.34,37.88 | v13.34,37 13.34,37.88 | R5.1 13.27,37.95 13.34,37.88
  Bottom 0.61: v13.34,37 26.5,37 27.48,36.02 T2.3 27.48,24.59 29.84,22.23 PAD21.1
DTR
  Bottom 0.61: T1.2 32.55,34.91 R2.1 32.54,37.31 PAD11.1
EN_IR1
  Top 0.61: U3.26 36.83,26.85 38.19,25.49 38.19,23.41 39.52,22.07 R9.1
EN_IR2
  Top 0.61: R7.1 20.32,22.07 U3.16
GND  (via drill 0.6 pad 1.3)
  Top 0.61: PAD2.1 5.08,60.96 4.45,60.33 v4.45,57.78 2.54,55.88 2.54,54.61 | U3.39 24.77,35.59 | 2.54,40.64 2.54,42.67 1.73,43.48 1.73,46.99 | 1.73,46.99 1.73,53.04 2.54,53.85 2.54,54.61 | v5.08,40.64 2.54,40.64 | U3.39 23.5,34.86 23.5,39.37 26.21,42.09 31.75,42.09 | 31.75,42.09 U3.38 | U3.39 23.77,34.56 23.5,34.29 20.95,34.29 19.05,32.38 U3.15 19.05,22.23 | 31.75,42.09 31.75,46.35 34.7,49.3 C1.2 40.51,49.3 40.65,49.45 PAD16.1 PAD5.1 | 19.05,22.23 v17.14,22.23 16.51,22.23 14.61,20.32 11.43,20.32 | U3.1 17.57,43.39 | 17.57,43.39 21.8,47.62 24.13,47.62 27.3,50.8 v27.3,51.24 27.3,53.98 C13.- 26.95,54.89 27.18,54.97 29.55,54.97 IC8.1 | v5.08,40.64 8.26,37.47 v8.26,37.27 | 8.26,20.32 8.81,19.76 8.81,15.97 5.63,12.79 5.63,9.61 7.94,7.3 7.94,3.81 | 8.26,20.32 6.35,22.23 3.81,22.23 C16.2 | C15.2 2.54,35.97 2.54,40.64 | PAD26.1 11.43,20.32 | T4.2 34.78,16.51 42.55,16.51 42.55,11.43 | 3.81,2.54 v3.17,3.17 4.45,1.91 8.26,1.91 | 42.55,9.53 42.55,2.54 40.01,2.54 38.73,3.81 38.73,5.08 35.56,8.26 31.75,8.26 25.4,1.91 8.26,1.91 | 42.55,9.53 42.55,11.43 | v40.01,9.53 42.55,9.53 | C22.2 42.55,11.43 | U$1.5 1.76,46.96 1.73,46.99 | C23.2 C24.2 C25.2 7.94,3.81 | 8.26,1.91 7.94,2.22 7.94,3.81 | v5.08,40.64 5.08,43.18 5.56,43.66 R32.2 | D5.C 2.54,54.61 | 17.57,43.39 14.38,46.59 C5.2 C26.2 | 9.63,22.12 v9.63,22.86 9.63,20.42 9.53,20.32 | 11.43,20.32 9.53,20.32 | 9.53,20.32 8.26,20.32 | 19.05,22.23 19.05,20.32 22.23,17.14 24.77,17.14 24.77,16.36 T5.2
  Bottom 0.305: U1.3 33.66,13.97 | 33.66,13.97 33.02,13.97 | 33.66,13.97 40.01,13.97 40.16,13.97
  Bottom 0.61: R10.1 23.01,47.07 C2.2 | C2.2 C3.2 23.09,42.62 22.86,42.39 15.09,42.39 14.61,41.91 | IC5.3 5.71,55.24 4.45,56.52 v4.45,57.78 4.45,58.9 3.17,60.17 R15.1 6.1,63.73 C7.2 C14.2 | v5.08,40.64 5.08,45.72 | T3.2 5.25,45.89 5.08,45.72 | 15.24,42.55 16.66,43.97 R26.1 16.83,44.28 | IC7.7 IC7.8 | 4.29,31.6 4.45,31.75 | IC7.8 19.05,26.04 | 14.61,41.91 | 14.61,41.91 15.24,42.55 | 15.24,42.55 | C2.2 24.88,48.78 | 24.88,48.78 27.3,51.2 v27.3,51.24 | IC7.9 9.63,23.5 v9.63,22.86 | C11.1 40.16,16.43 40.16,13.97 R42.2 40.16,9.68 v40.01,9.53 | v9.63,22.86 9.63,20.95 C21.2 11.91,20.88 R20.1 11.91,16.66 12.06,16.51 | 40.01,13.97 33.02,13.97 32.38,13.97 31.75,14.61 30.48,14.61 | 4.29,31.6 R29.1 4.21,32.46 C6.2 4.21,36.41 5.08,37.27 v8.26,37.27 9.97,37.27 15.24,42.55 | 4.29,31.6 R28.1 R27.1 R30.1 4.29,23.65 5.71,22.23 8.99,22.23 v9.63,22.86 | IC2.4 30.48,14.61 | 5.08,50.16 C12.2 7.41,50.19 IC5.1 | 5.08,50.16 4.45,50.16 R3.1 | 5.08,45.72 5.08,50.16 | PAD23.1 24.88,48.78 | R31.2 R23.1 5.79,3.02 C19.1 3.4,2.94 v3.17,3.17 | IC1.4 13.34,7.62 12.06,8.89 12.06,12.06 11.43,12.7 10.19,12.7 10.17,12.71 10.17,16.5 10.19,16.51 12.06,16.51 | 20.8,23.98 R37.1 18.9,23.98 | v17.14,22.23 18.9,23.98 | 18.9,23.98 18.9,25.45 IC7.8 | R24.1 30.48,12.85 30.48,14.61 | 12.06,16.51 16.03,16.51 16.66,15.88 R18.1 18.57,12.7 XR1.E 20.87,12.7 21.44,12.13 R1.1 | C10.2 9.53,22.76 v9.63,22.86
IO0  (via drill 0.6 pad 1.3)
  Top 0.61: v36.2,24.77 35.38,25.58 U3.25
  Bottom 0.61: R8.2 34.29,39.37 35.56,38.1 35.56,31.11 | 35.56,31.11 35.56,28.57 36.2,27.94 v36.2,24.77 36.2,24.13 PAD22.1 | T1.3 35.56,31.11
IO18
  Top 0.61: U3.30 35.38,31.93 36.83,30.48 38.73,30.48 40.01,29.21 PAD28.1
IO19
  Top 0.61: U3.31 36.02,33.2 37.47,31.75 PAD29.1
IO25
  Top 0.61: U3.10 13.52,30.66 9.53,26.67 PAD27.1
IO26
  Top 0.61: U3.11 14.15,29.39 8.89,24.13 PAD17.1
IO32
  Top 0.61: U3.8 12.24,33.2 10.79,31.75 PAD18.1
IO33
  Top 0.61: U3.9 16.19,31.85 12.48,31.85 9.84,29.21 PAD14.1
IR1_LED_ANODE
  Top 0.61: R6.1 PAD8.1
IR1_LED_CATHODE
  Top 0.61: PAD7.1 T4.3
IR2_LED_ANODE
  Top 0.61: R4.2 17.14,8.74 17.14,15.88 17.78,16.51 XR1.A
IR2_LED_CATHODE  (via drill 0.6 pad 1.3)
  Top 0.61: T5.3 21.59,14.44 v21.59,13.97
  Bottom 0.61: v21.59,13.97 20.52,13.97 XR1.CATH
N$1
  Top 0.61: R40.1 7.47,54.13 6.99,54.61 D5.A
N$2
  Bottom 0.61: D4.C R39.1
N$3
  Top 0.61: T5.1 26.36,14.29 26.67,14.61 26.67,19.05 26.04,19.68 R7.2
N$4
  Bottom 0.61: D3.C R38.1
N$5
  Bottom 0.61: R11.2 32.54,30.78 T1.1
N$6
  Bottom 0.61: IC2.5 24.28,14.39 R1.2 24.28,12.52 22.86,11.1 22.86,8.26 24.13,6.99 C17.1
N$8
  Top 0.61: T4.1 35.41,20.95 R9.2
N$9
  Bottom 0.305: U1.1 35.7,12.55 36.83,11.43 R42.1
N$10
  Bottom 0.61: R18.2 13.34,14.61 | 13.34,14.61 R19.1 | 13.34,14.61 13.34,9.53 13.97,8.89 IC1.3
N$11
  Bottom 0.61: IC7.6 20.32,28.57 21.59,27.3 R37.2
N$12
  Bottom 0.61: C18.2 19.13,21.11 R17.1 21.74,20.95 24.13,20.95 26.04,19.05 26.04,17.14 | 26.04,17.14 IC2.7 | C8.2 25.17,10.16 25.4,10.16 26.04,10.79 26.04,17.14
N$13
  Bottom 0.61: T3.1 10.47,43.34 R13.2
N$14
  Bottom 0.61: R20.2 14.99,18.18 C18.1 19.13,18.26 R17.2 21.59,16.51 22.23,15.88 IC2.6
N$15
  Bottom 0.61: R23.2 7.62,6.5 7.62,8.26 7.14,8.74 R21.1 7.14,8.89 IC1.6
N$16
  Bottom 0.61: C20.1 12.7,3.58 12.7,3.97 R31.1 10.79,6.92 IC1.5
N$17
  Bottom 0.61: R22.1 R21.2 5.71,11.58 5.71,11.43 6.99,10.16 IC1.7
N$18
  Bottom 0.61: T2.1 29.68,34.91 R2.2
N$29
  Bottom 0.61: C8.1 27.54,12.45 R24.2 27.3,13.18 27.3,15.24 27.94,15.88 IC2.3
N$39
  Bottom 0.61: 21.44,32.38 21.44,31.83 C9.1 21.59,31.52 21.59,30.48 24.77,27.3 24.77,22.23 27.3,19.68 27.3,17.78 27.94,17.14 IC2.2 | 21.44,32.38 R25.2 | IC7.3 21.44,32.38
N$40
  Bottom 0.61: IC7.13 10.52,31.11 8.89,29.49 8.89,27.3 R27.2
N$41
  Bottom 0.61: IC7.14 10.14,32.38 7.6,29.84 R28.2
N$42
  Bottom 0.61: IC7.15 9.53,33.66 8.26,32.38 R29.2
N$43
  Bottom 0.61: IC7.12 10.79,29.84 10.16,29.21 10.16,26.67 8.26,24.77 R30.2
PHOTO_TRANS_COLLECTOR
  Bottom 0.61: 18.26,10.16 R12.1 18.18,8.18 C4.1 | IC1.2 18.26,10.16 | 18.26,10.16 19.53,11.43 XR1.COLL
PHOTODIODE_1_ADC  (via drill 0.6 pad 1.3)
  Top 0.61: v15.88,5.71 15.24,6.35 v15.24,12.7
  Bottom 0.305: 32.38,10.79 32.38,11.43 32.66,11.7 U1.5
  Bottom 0.61: C4.2 21.17,6.41 | 21.17,6.41 21.18,8.81 R12.2 | C20.2 15.64,5.95 v15.88,5.71 15.88,4.45 20.95,4.45 | 20.95,4.45 21.17,4.66 21.17,6.41 | v15.24,12.7 15.3,12.64 IC1.1 | 20.95,4.45 25.4,4.45 27.1,6.15 27.1,6.55 C17.2 | C17.2 27.54,7.21 27.94,7.62 C17.2 | 32.38,10.79 32.38,10.16 32.07,9.84 30.8,9.84 27.94,6.99 C17.2
PHOTODIODE_2_ADC
  Bottom 0.305: U1.7 33.16,18.91
  Bottom 0.61: 33.16,18.91 33.02,19.05 PAD9.1
PPG_SIGNAL_1_ADC
  Bottom 0.305: U1.6 32.66,17.51 32.38,17.78
  Bottom 0.61: R25.1 24.36,34.85 C9.2 24.36,30.25 26.04,28.57 26.04,23.27 30.37,18.94 | IC2.1 29.8,18.94 30.37,18.94 | 32.38,17.78 31.53,17.78 30.37,18.94
PPG_SIGNAL_2_ADC
  Bottom 0.305: U1.4 33.16,11.76 33.41,11.51 33.41,10.79
  Bottom 0.61: C19.2 2.54,5.95 | 2.54,5.95 1.65,5.95 1.32,5.61 1.32,1.32 24.82,1.32 31.67,8.18 32.31,8.18 33.41,9.28 33.41,10.79 | R22.2 2.54,5.95
PPG_SIGNAL_GAIN_A  (via drill 0.6 pad 1.3)
  Top 0.61: v14.01,22.86 14.01,26.07 14.79,26.85 U3.13
  Bottom 0.61: IC7.11 15.24,28.57 15.24,24.3 14.01,23.07 v14.01,22.86
PPG_SIGNAL_GAIN_B  (via drill 0.6 pad 1.3)
  Top 0.61: U3.12 14.61,28.12 11.43,24.95 v11.43,22.86
  Bottom 0.61: v11.43,22.86 11.58,22.86 14.12,25.4 14.12,27.21 14.03,27.3 IC7.10
R_PROG
  Bottom 0.61: IC5.2 4.93,53.98 R3.2
RTS
  Bottom 0.61: T2.2 29.69,30.78 R11.1 29.69,26.52 30.18,26.04 PAD15.1
SCL  (via drill 0.6 pad 1.3)
  Top 0.61: PAD3.1 40.87,41.6 40.56,41.91 38.73,41.91 v37.47,40.64 36.38,39.55 U3.36
  Bottom 0.305: U1.10 35.35,17.35 | 36.94,18.94 38.77,20.77
  Bottom 0.61: R43.1 34.27,43.81 35.18,42.9 35.2,42.9 v37.47,40.64 38.1,40.64 39.37,39.37 39.37,21.37 36.94,18.94 35.35,17.35
SDA  (via drill 0.6 pad 1.3)
  Top 0.61: U3.33 35.56,35.74 37.01,34.29 37.47,34.29 | 37.47,34.29 PAD4.1 | v37.66,34.92 37.47,34.73 37.47,34.29
  Bottom 0.305: U1.9 34.16,17.78
  Bottom 0.61: v37.66,34.92 37.47,34.92 | v37.66,34.92 37.66,37.91 34.29,41.27 R44.1 | 34.16,17.78 37.66,21.28 v37.66,34.92
V_BATT  (via drill 0.6 pad 1.3)
  Top 0.61: PAD1.1 11.43,61.59 v15.24,61.59 15.88,62.23 20.28,62.23 Q5.3
  Bottom 0.61: R16.2 14.45,60.81 v15.24,61.59 | IC5.5 12.7,56.73 R16.2 | C14.1 12.62,60.73 R16.2
V_BATT_ADC  (via drill 0.6 pad 1.3)
  Top 0.61: U3.7 10.79,34.47 9.98,33.66 4.21,33.66 C16.1 1.9,33.25 v1.67,33.02
  Bottom 0.61: R16.1 12.7,64.77 11.43,66.04 4.45,66.04 3.17,64.77 R15.2 3.02,63.5 1.32,63.5 1.32,33.02 v1.67,33.02
V_USB  (via drill 0.6 pad 1.3)
  Top 0.61: 18.04,52.71 D1.A 18.41,52.07 | 18.04,52.71 Q5.1 | 18.41,52.07 v16.51,52.07 14.49,52.07 10.16,56.4 | 18.04,52.71 18.04,52.45 18.41,52.07 | v14.61,66.04 14.03,66.61 8.83,66.61 8.26,66.04 8.26,59.05 v8.89,58.42 10.16,57.15 10.16,56.4 | U$1.1 6.99,49.56 7.62,50.2 R40.2 7.77,51.44 9.53,51.44 10.16,52.07 10.16,56.4 | v38.73,52.7 39.37,52.07 PAD25.1
  Bottom 0.61: R14.1 R35.2 | R14.1 R10.2 20.17,47.07 C2.1 C3.1 | v16.51,52.07 16.66,51.92 R14.1 | v14.61,66.04 24.77,66.04 | C7.1 6.35,58.42 | 6.35,58.42 6.35,57.58 IC5.4 | v8.89,58.42 6.35,58.42 | 24.77,66.04 24.77,62.46 D4.A D3.A | 24.77,66.04 31.29,66.04 39.37,57.96 39.37,56.52 38.73,55.88 v38.73,52.7
V_USB_ADC  (via drill 0.6 pad 1.3)
  Top 0.61: U3.6 6.35,35.74 | C15.1 6.58,35.51 6.35,35.74 | 6.35,35.74 4.45,37.65 v4.45,38.73
  Bottom 0.61: R35.1 R26.2 13.82,43.03 9.53,38.73 v4.45,38.73
VIN
  Top 0.61: IC8.2 36.2,55.27 | 36.2,55.27 C1.1 36.41,52.52 | PAD20.1 41.26,55.27 36.2,55.27
VIN_SW  (via drill 0.6 pad 1.3)
  Top 0.61: 22.6,54.98 Q5.2 | Q5.2 22.6,55.62 24.13,57.15 24.13,63.5 24.77,64.14 v26.67,64.14 | PAD19.1 40.66,57.68 40.55,57.78 38.73,57.78 38.1,57.15 v37.47,57.15 | D1.C 22.23,52.07 22.6,52.45 Q5.2
  Bottom 0.61: v26.67,64.14 27.94,64.14 34.92,57.15 v37.47,57.15
(copper drawn outside any net)
  shapes: Bottom circle x6, Top area x2, Top circle x6

### Text on the board
Top: NIRGM / V8